# Altium schematic sheet CP_Scheme.SchDoc: Название платы
size 594 x 420 mm; ApprovedBy: Рогов; CheckedBy: Фамилия проверяющего; DrawnBy: Фамилия разработчика; DocumentNumber: Введите номер платы + Э3; SheetNumber: пусто если листов 1, иначе 1; SheetTotal: количество листов; Format: A2; DocumentType: тип схемы; Title1str: (вторая строка при необходимости); ImagePath: Введите номер платы
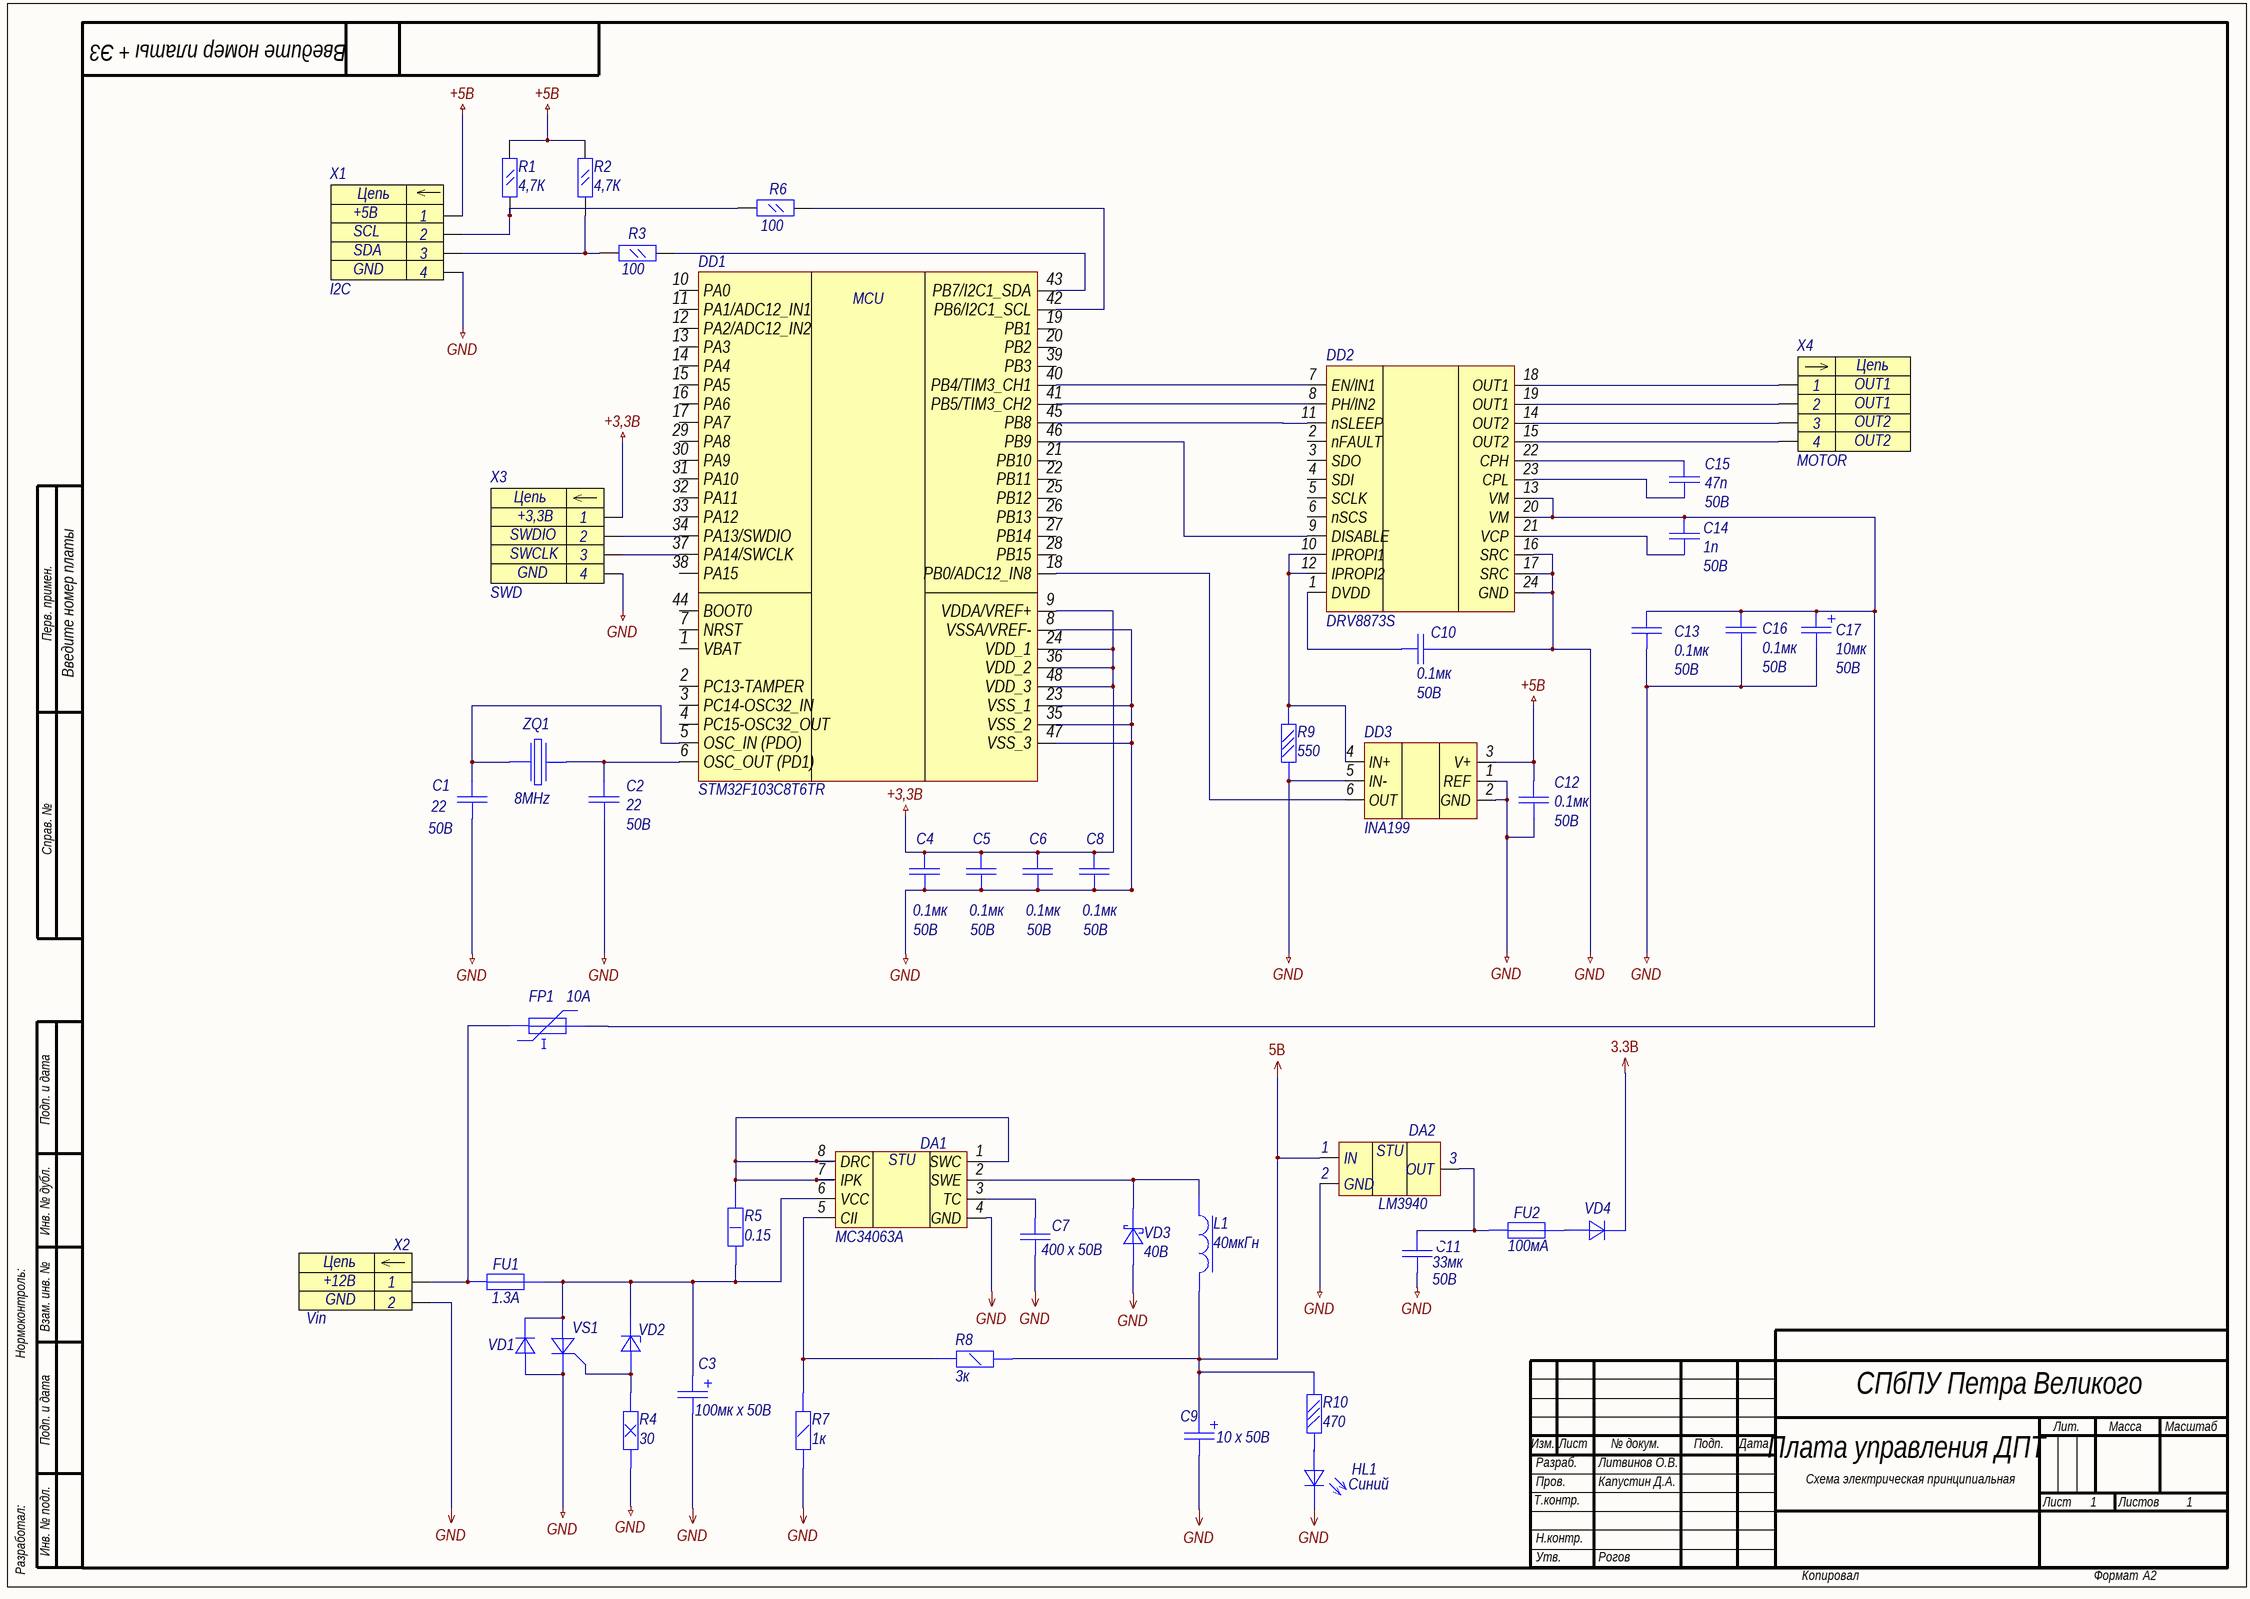
[diagram p0: CP_Scheme.SchDoc]

## Parts
C1  value 22  Voltage: 50В  [C0603]  (hidden comment: Capacitor)
C2  value 22  Voltage: 50В  [C0603]  (hidden comment: Capacitor)
C3  Ёмкость: 100мк х 50В  [C1206]  (hidden comment: Capacitor-E)
C4  value 0.1мк  Voltage: 50В  [C0603]  (hidden comment: Capacitor)
C5  value 0.1мк  Voltage: 50В  [C0603]  (hidden comment: Capacitor)
C6  value 0.1мк  Voltage: 50В  [C0603]  (hidden comment: Capacitor)
C7  Ёмкость: 400 х 50В  [R0805]  (hidden comment: Capacitor)
C8  value 0.1мк  Voltage: 50В  [C0603]  (hidden comment: Capacitor)
C9  Ёмкость: 10 х 50В  [C1206]  (hidden comment: Capacitor-E)
C10  value 0.1мк  Voltage: 50В  [C0603]  (hidden comment: Capacitor)
C11  value 33мк  Voltage: 50В  [C0805]  (hidden comment: Capacitor)
C12  value 0.1мк  Voltage: 50В  [C0603]  (hidden comment: Capacitor)
C13  value 0.1мк  Voltage: 50В  [C0603]  (hidden comment: Capacitor)
C14  value 1п  Voltage: 50В  [C0603]  (hidden comment: Capacitor)
C15  value 47п  Voltage: 50В  [C0603]  (hidden comment: Capacitor)
C16  value 0.1мк  Voltage: 50В  [C0603]  (hidden comment: Capacitor)
C17  value 10мк  Voltage: 50В  [C3216-p]  (hidden comment: Capacitor-T)
DA1  MC34063A  [PCBComponent_1]
DA2  LM3940  [SOT95P237X112-3N]
DD1  STM32F103C8T6TR  [LQFP-48]
DD2  DRV8873S  [28_Pins]
DD3  INA199  [SOT23-6_N]
FP1  Rated Current: 10А  [F1812]  (hidden comment: Fuse_PTC)
FU1  value 1.3A  [F1812]  (hidden comment: Fuse)
FU2  value 100мA  [F1812]  (hidden comment: Fuse)
HL1  Цвет: Синий  [LD0805]  (hidden comment: LED_3V)
L1  value 40мкГн  [МДГ-2]  (hidden comment: Coil)
R1  Impedance: 4,7К  [R0805]  (hidden comment: Res_0.125)
R2  Impedance: 4,7К  [R0805]  (hidden comment: Res_0.125)
R3  Impedance: 100  [R0805]  (hidden comment: Res_0.125)
R4  Сопротивление: 30  [R0805]  (hidden comment: Resistor_10,0W)
R5  value 0.15  [R0805]  (hidden comment: Resistor_1,0W)
R6  Impedance: 100  [R0805]  (hidden comment: Res_0.125)
R7  value 1к  [R0805]  (hidden comment: Resistor_0,25W)
R8  value 3к  [R0805]  (hidden comment: Resistor_0,25W)
R9  value 550  [R0402]  (hidden comment: Resistor_0,05W)
R10  Сопротивление: 470  [R0805]  (hidden comment: Resistor_0,05W)
VD1  Diode  [SOD-123]  (value not drawn)
VD2  Suppressor  [DO-214AA]  (value not drawn)
VD3  Максимальное обратное напряжение: 40В  [DO-214AC]  (hidden comment: Schottky)
VD4  Diode  [SOD-123]  (value not drawn)
VS1  tiristor  [SOT95P237X112-3N]  (value not drawn)
X1  I2C  Clock: SCL  Data: SDA  U: +5В  [CWF-4]
X2  Vin  U: +12В  [DJK-02-Series]
X3  SWD  [WF-4]
X4  MOTOR  [90136-1x04]
ZQ1  Output Frequency: 8MHz  [SMD 6x3.5mm]  (hidden comment: Crystal)

## Nets
3.3В: VD4.2(К)
5В: C9.1 DA2.1(IN) L1.2 R8.2 R10.2
+3,3В: C4.2 C5.2 C6.2 C8.2 DD1.9(VDDA/VREF+) DD1.24(VDD_1) DD1.36(VDD_2) DD1.48(VDD_3) X3.1
+5В: C12.2 DD3.3(V+) R1.1(C1-) R2.1(C1-) X1.1
GND: C1.2 C2.2 C3.2 C4.1 C5.1 C6.1 C7.1 C8.1 C9.2 C10.2 C11.2 C12.1 C13.1 C16.2 C17.2 DA1.4(GND) DA2.2(GND) DD1.8(VSSA/VREF-) DD1.23(VSS_1) DD1.35(VSS_2) DD1.47(VSS_3) DD2.16(SRC) DD2.17(SRC) DD2.24(GND) DD3.1(REF) DD3.2(GND) DD3.5(IN-) HL1.2(К) R4.1 R7.1 R9.1 VD1.1(А) VD3.1(А) VS1.3(К) X1.4 X2.2 X3.4
NetC1_1: C1.1 DD1.5(OSC_IN_(PDO)) ZQ1.1
NetC2_1: C2.1 DD1.6(OSC_OUT_(PD1)) ZQ1.3
NetC3_1: C3.1 DA1.6(VCC) FU1.2 R5.1 VD1.2(К) VD2.2(К) VS1.2(А)
NetC7_2: C7.2 DA1.3(TC)
NetC10_1: C10.1 DD2.1(DVDD)
NetC11_1: C11.1 DA2.3(OUT) FU2.1
NetC13_2: C13.2 C14.2 C16.1 C17.1 DD2.13(VM) DD2.20(VM) FP1.2
NetC14_1: C14.1 DD2.21(VCP)
NetC15_1: C15.1 DD2.23(CPL)
NetC15_2: C15.2 DD2.22(CPH)
NetDA1_1: DA1.1(SWC) DA1.7(IPK) DA1.8(DRC) R5.2
NetDA1_2: DA1.2(SWE) L1.1 VD3.2(К)
NetDA1_5: DA1.5(CII) R7.2 R8.1
NetDD1_18: DD1.18(PB0/ADC12_IN8) DD3.6(OUT)
NetDD1_34: DD1.34(PA13/SWDIO) X3.2
NetDD1_37: DD1.37(PA14/SWCLK) X3.3
NetDD1_40: DD1.40(PB4/TIM3_CH1) DD2.7(EN/IN1)
NetDD1_41: DD1.41(PB5/TIM3_CH2) DD2.8(PH/IN2)
NetDD1_42: DD1.42(PB6/I2C1_SCL) R6.2(C1-)
NetDD1_43: DD1.43(PB7/I2C1_SDA) R3.2(C1-)
NetDD1_45: DD1.45(PB8) DD2.11(nSLEEP)
NetDD1_46: DD1.46(PB9) DD2.9(DISABLE)
NetDD2_10: DD2.10(IPROPI1) DD2.12(IPROPI2) DD3.4(IN+) R9.2
NetDD2_14: DD2.14(OUT2) X4.3
NetDD2_15: DD2.15(OUT2) X4.4
NetDD2_18: DD2.18(OUT1) X4.1
NetDD2_19: DD2.19(OUT1) X4.2
NetFP1_1: FP1.1 FU1.1 X2.1
NetFU2_2: FU2.2 VD4.1(А)
NetHL1_1: HL1.1(А) R10.1
NetR1_2: R1.2(C1-) R6.1(C1-) X1.2
NetR2_2: R2.2(C1-) R3.1(C1-) X1.3
NetR4_2: R4.2 VD2.1(А) VS1.1(G)

Not connected (* = marked no-connect by the designer): DD1 1(VBAT) 2(PC13-TAMPER) 3(PC14-OSC32_IN) 4(PC15-OSC32_OUT) 7(NRST) 10(PA0) 11(PA1/ADC12_IN1) 12(PA2/ADC12_IN2) 13(PA3) 14(PA4) 15(PA5) 16(PA6) 17(PA7) 19(PB1) 20(PB2) 21(PB10) 22(PB11) 25(PB12) 26(PB13) 27(PB14) 28(PB15) 29(PA8) 30(PA9) 31(PA10) 32(PA11) 33(PA12) 38(PA15) 39(PB3) 44(BOOT0); DD2 2(nFAULT) 3(SDO) 4(SDI) 5(SCLK) 6(nSCS)

## Notes on the sheet
- Перв. примен.
- Справ. №
- Подп. и дата
- Инв. № дубл.
- (near C11) +
- Нормоконтроль:
- Взам. инв. №
- СПбПУ Петра Великого
- Изм.
- Лист
- № докум.
- Подп.
- Дата
- Плата управления ДПТ
- Лит.
- Масса
- Масштаб
- Т.контр.
- Пров.
- Разраб.
- Капустин Д.А.
- Литвинов О.В.
- Схема электрическая принципиальная
- 1
- Листов
- Разработал:
- Инв. № подл.
- Н.контр.
- Утв.
- Копировал
- Формат
- (in symbol I2C_2) Цепь
- (in symbol LM3940) STU
- (in symbol MC34063A) STU
- (in symbol OUTPUT_MOTOR) Цепь; OUT1; OUT2
- (in symbol STM32F103C8T6TR) MСU
- (in symbol SWD) Цепь; +3,3В; SWDIO; SWCLK; GND
- (in symbol Vin) Цепь

## Library data of the parts
C1 C2 C4-C8 C10-C16 = Capacitor: Type: Конденсатор
  C7: Published: 18.05.2010; Publisher: Andrew Danich
C3 C9 = Capacitor-E: Type: Конденсатор; Published: 20.08.2010; Publisher: Олег Литвинов
C17 = Capacitor-T: Type: Конденсатор
FP1 = miniSMDC050F-2: ID: 3; Limit Voltage: 24V; Resistance: 1ohm; Published: 25.0.2017; Value: miniSMDC050F-2; Type: Предохранитель самовосстанавливающийся; Part Number: miniSMDC050F-2
HL1 = Led-1: Type: Индикатор единичный; Прямое напряжение: 3.3В; Произв. номер: SMLE13EC8TT86; Прямой ток: 3мА; Published: 03.12.2013; Publisher: Andrew Danich
L1 = КИВ18-100: Manufacturer: ОАО "МСТАТОР"; Type: Дроссель; ID: 1; Rated Current: 185mA; Tolerance: ±10%; Q: 20; DC Resistance: 1.2ohm; Specification: КВШУ.670114.001 ТУ; Application Category: 5; Working Temperature Min: -60°С; Working Temperature Max: +85°С; Published: 20.05.2010; Publisher: Andrew Danich; Part Number: КИВ18-100; Footprint: 0603
R1-R3 R6 = Res_0.125: Manufacture: Panasonic Industrial Devices; Model: ERJ-6ENF2323V; Case: 0805; HelpURL: https://ru.mouser.com/ProductDetail/Panasonic-Industrial-Devices/ERJ-6ENF2323V?qs=sGAEpiMZZMvdGkrng054tx7%2f6%252bNA3LAJkwXIsOwAlfs%3d
VD1 VD4 = Diode: Type: Диод
VD2 = Suppressor: Type: Супрессор; Напряжение: 12В
VD3 = Schottky: BYV10-40; Type: Диод; Прямой ток: 1 А
X1 = I2C_2: Create: DeathSpeaker; GND: GND
X2 = Vin: Create: DeathSpeaker; Out: D-; In: D+; GND: GND
X4 = OUTPUT_MOTOR
ZQ1 = РК463-8ВП-8000К: Manufacturer: ОАО "ПЬЕЗО"; ID: 6; Specification: КЖБД.433514.020 ТУ; Application Category: 5; Working Temperature Min: -40°С; Working Temperature Max: +70°С; Published: 08.03.2013; Publisher: Andrew Danich; Type: Резонатор; Part Number: РК463-8ВП-8000К; Value: РК463-8ВП-8000К; Functional Analog: -
DA2 = LM3940: Item ID: LM3940
FU1 FU2 = Fuse: Type: Вставка плавкая
R4 = Resistor_10,0W: Type: Резистор
R5 = Resistor_1,0W: Type: Резистор
R7 R8 = Resistor_0,25W: Type: Резистор
R9 R10 = Resistor_0,05W: Type: Резистор